# Altium schematic sheet s2m4x.SchDoc
size Legal; SheetNumber: 1; SheetTotal: 1
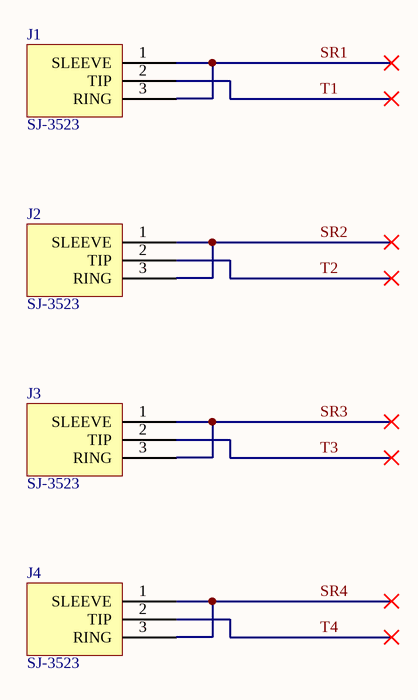
[diagram p0: s2m4x.SchDoc]

## Parts
J1  SJ-3523  [SJ-352X]
J2  SJ-3523  [SJ-352X]
J3  SJ-3523  [SJ-352X]
J4  SJ-3523  [SJ-352X]

## Nets
SR1: J1.1(SLEEVE) J1.3(RING)
SR2: J2.1(SLEEVE) J2.3(RING)
SR3: J3.1(SLEEVE) J3.3(RING)
SR4: J4.1(SLEEVE) J4.3(RING)
T1: J1.2(TIP)
T2: J2.2(TIP)
T3: J3.2(TIP)
T4: J4.2(TIP)